# Altium schematic sheet lock_in_amplifier.SchDoc
size Letter; SheetNumber: 2; SheetTotal: 3
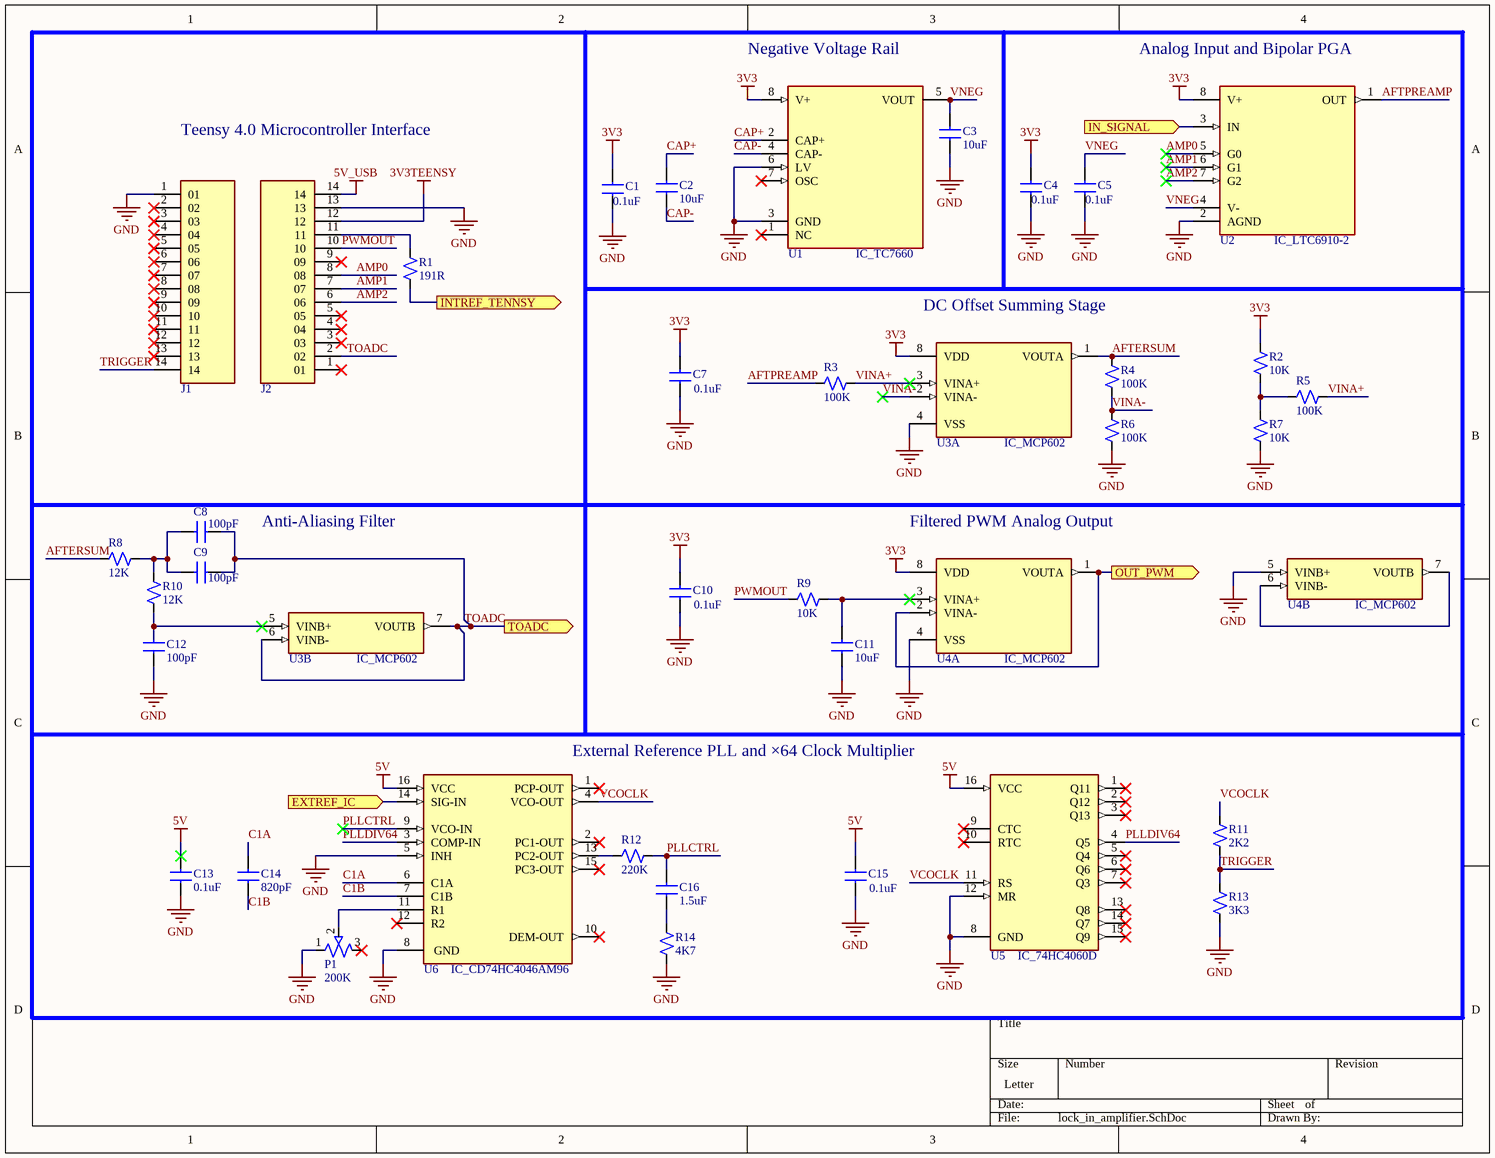
[diagram p0: lock_in_amplifier.SchDoc]

## Parts
C1  value 0.1uF  [CAP_0603]  (hidden comment: CAP_100nF_50V)
C2  value 10uF  [CAP_0805]  (hidden comment: CAP_10uF_16V)
C3  value 10uF  [CAP_0805]  (hidden comment: CAP_10uF_16V)
C4  value 0.1uF  [CAP_0603]  (hidden comment: CAP_100nF_50V)
C5  value 0.1uF  [CAP_0603]  (hidden comment: CAP_100nF_50V)
C7  value 0.1uF  [CAP_0603]  (hidden comment: CAP_100nF_50V)
C8  value 100pF  [CAP_0805]  (hidden comment: CAP_100pF_25V)
C9  value 100pF  [CAP_0805]  (hidden comment: CAP_100pF_25V)
C10  value 0.1uF  [CAP_0603]  (hidden comment: CAP_100nF_50V)
C11  value 10uF  [CAP_0805]  (hidden comment: CAP_10uF_16V)
C12  value 100pF  [CAP_0805]  (hidden comment: CAP_100pF_25V)
C13  value 0.1uF  [CAP_0603]  (hidden comment: CAP_100nF_50V)
C14  value 820pF  [CAP_0805]  (hidden comment: CAP_820pF_25V)
C15  value 0.1uF  [CAP_0603]  (hidden comment: CAP_100nF_50V)
C16  value 1.5uF  [CAP_0805]  (hidden comment: CAP_1.5uF_16V)
J1  SSW-114-01-X-S  [SAMTEC_SSW-114-01-X-S]  (value not drawn)
J2  SSW-114-01-X-S  [SAMTEC_SSW-114-01-X-S]  (value not drawn)
P1  value 200K  [POT_PDB181-K420K-204B]  (hidden comment: POT_200K)
R1  value 191R  [RES_0603]  (hidden comment: RES_191R_0603)
R2  value 10K  [RES_0603]  (hidden comment: RES_10K_0603)
R3  value 100K  [RES_0603]  (hidden comment: RES_100K_0603)
R4  value 100K  [RES_0603]  (hidden comment: RES_100K_0603)
R5  value 100K  [RES_0603]  (hidden comment: RES_100K_0603)
R6  value 100K  [RES_0603]  (hidden comment: RES_100K_0603)
R7  value 10K  [RES_0603]  (hidden comment: RES_10K_0603)
R8  value 12K  [RES_0603]  (hidden comment: RES_12K_0603)
R9  value 10K  [RES_0603]  (hidden comment: RES_10K_0603)
R10  value 12K  [RES_0603]  (hidden comment: RES_12K_0603)
R11  value 2K2  [RES_0603]  (hidden comment: RES_2K2_0603)
R12  value 220K  [RES_0603]  (hidden comment: RES_220K_0603)
R13  value 3K3  [RES_0603]  (hidden comment: RES_3K3_0603)
R14  value 4K7  [RES_0603]  (hidden comment: RES_4K7_0603)
U1  IC_TC7660  [IC_TC7660EOA]
U2  IC_LTC6910-2  [IC_LTC6910-2CTS8#TRMPBF]
U3  IC_MCP602  [IC_MCP602T-I/SN]  (parts A,B of 2)
U4  IC_MCP602  [IC_MCP602T-I/SN]  (parts A,B of 2)
U5  IC_74HC4060D  [IC_74HC4060D-Q100,118]
U6  IC_CD74HC4046AM96  [IC_CD74HC4046AM96]

## Ports
EXTREF_IC (in, see main[3B]), IN_SIGNAL (in, see main[3B]), INTREF_TENNSY (out, see main[3B]), OUT_PWM (out, see main[3B]), TOADC (out, see main[3C])

## Nets
3V3: C1.2 C4.2 C7.2 C10.2 R2.2 U1.8(V+) U2.8(V+) U3.8(VDD) U4.8(VDD)
3V3TEENSY: J2.12
5V: C13.2 C15.2 U5.16(VCC) U6.16(VCC)
5V_USB: J2.14
GND: C1.1 C3.1 C4.1 C5.1 C7.1 C10.1 C11.1 C12.1 C13.1 C15.1 J1.1(01) J2.13 P1.1 R6.1 R7.1 R13.1 R14.1 U1.3(GND) U1.6(LV) U2.2(AGND) U3.4(VSS) U4.4(VSS) U4.5(VINB+) U5.8(GND) U5.12(MR) U6.5(INH) U6.8(GND)
AFTERSUM: R4.2 R8.1 U3.1(VOUTA)
AFTPREAMP: R3.1 U2.1(OUT)
AMP0: J2.8(08) U2.5(G0)
AMP1: J2.7(07) U2.6(G1)
AMP2: J2.6(06) U2.7(G2)
C1A: C14.2 U6.6(C1A)
C1B: C14.1 U6.7(C1B)
CAP+: C2.2 U1.2(CAP+)
CAP-: C2.1 U1.4(CAP-)
EXTREF_IC: U6.14(SIG-IN) ; port EXTREF_IC
IN_SIGNAL: U2.3(IN) ; port IN_SIGNAL
INTREF_TENNSY: R1.1 ; port INTREF_TENNSY
OUT_PWM: U4.1(VOUTA) U4.2(VINA-) ; port OUT_PWM
PLLCTRL: C16.2 R12.1 U6.9(VCO-IN)
PLLDIV64: U5.4(Q5) U6.3(COMP-IN)
PWMOUT: J2.10 R9.1
TOADC: C8.2 C9.2 J2.2(02) U3.6(VINB-) U3.7(VOUTB) ; port TOADC
TRIGGER: J1.14 R11.1 R13.2
VCOCLK: R11.2 U5.11(RS) U6.4(VCO-OUT)
VINA+: R3.2 R5.1 U3.3(VINA+)
VINA-: R4.1 R6.2 U3.2(VINA-)
VNEG: C3.2 C5.2 U1.5(VOUT) U2.4(V-)
NetC8_1: C8.1 C9.1 R8.2 R10.2
NetC11_2: C11.2 R9.2 U4.3(VINA+)
NetC12_2: C12.2 R10.1 U3.5(VINB+)
NetC16_1: C16.1 R14.2
NetJ2_11: J2.11 R1.2
NetP1_2: P1.2 U6.11(R1)
NetR2_1: R2.1 R5.2 R7.2
NetR12_2: R12.2 U6.13(PC2-OUT)
NetU4_6: U4.6(VINB-) U4.7(VOUTB)

Not connected (* = marked no-connect by the designer): J1 2(02)* 3(03)* 4(04)* 5(05)* 6(06)* 7(07)* 8(08)* 9(09)* 10* 11* 12* 13*; J2 1(01)* 3(03)* 4(04)* 5(05)* 9(09)*; P1 3*; U1 1(NC)* 7(OSC)*; U5 1(Q11)* 2(Q12)* 3(Q13)* 5(Q4)* 6(Q6)* 7(Q3)* 9(CTC)* 10(RTC)* 13(Q8)* 14(Q7)* 15(Q9)*; U6 1(PCP-OUT)* 2(PC1-OUT)* 10(DEM-OUT)* 12(R2)* 15(PC3-OUT)*

## Notes on the sheet
- (near U1) Negative Voltage Rail
- (near U2) Analog Input and Bipolar PGA
- Teensy 4.0 Microcontroller Interface
- DC Offset Summing Stage
- Anti-Aliasing Filter
- (near U4) Filtered PWM Analog Output
- External Reference PLL and ×64 Clock Multiplier

## Library data of the parts
C1 C4 C5 C7 C10 C13 C15 = CAP_100nF_50V: 50V 100nF Y5V -20%~+80% 0603; Manufacturer: Walsin Tech Corp; Manufacturer PN: 0603F104Z500CT; Supplier 1: LCSC; ComponentLink1Description: LCSC; ComponentLink1URL: https://www.lcsc.com/product-detail/Multilayer-Ceramic-Capacitors-MLCC-SMD-SMT_Walsin-Tech-Corp-0603F104Z500CT_C83060.html
C2 C3 C11 = CAP_10uF_16V: CAP CER 10UF 25V X5R 0805 ±10%; Manufacturer: Samsung Electro-Mechanics; Manufacturer PN: CL21A106KAYNNNE; Supplier 1: LCSC; ComponentLink2Description: LCSC; ComponentLink2URL: https://lcsc.com/product-detail/Multilayer-Ceramic-Capacitors-MLCC-SMD-SMT_Samsung-Electro-Mechanics-CL21A106KAYNNNE_C15850.html
C8 C9 C12 = CAP_100pF_25V: CAP CER 100PF 25V C0G/NP0 0805 ±5%; Manufacturer: KEMET; Manufacturer PN: C0805C101J3GACTU; Supplier 1: Digi-key; ComponentLink1Description: Digi-key; ComponentLink1URL: https://www.digikey.com/en/products/detail/kemet/C0805C101J3GACTU/2211639
C14 = CAP_820pF_25V: CAP CER 820PF 16V C0G/NP0 0805 ±5%; Manufacturer: Vishay Vitramon; Manufacturer PN: VJ0805D821JXJQJHT; Supplier 1: Digi-key; ComponentLink1Description: Digi-key; ComponentLink1URL: https://www.digikey.com/en/products/detail/vishay-vitramon/VJ0805D821JXJQJHT/14292859
C16 = CAP_1.5uF_16V: CAP CER 0805 1.5UF 16V X7R 5%; Manufacturer: KEMET; Manufacturer PN: C0805C155J4REC7210; Supplier 1: Digi-key; ComponentLink1Description: Digi-key; ComponentLink1URL: https://www.digikey.com/en/products/detail/kemet/C0805C155J4REC7210/8645141
J1 J2 = SSW-114-01-X-S: 14 Position Receptacle Connector 0.100 (2.54mm) Through Hole Gold; Manufacturer: Samtec Inc.; Manufacturer PN: SSW-114-01-G-S; Supplier 1: Digi-key; ComponentLink1Description: Digi-key; ComponentLink1URL: https://www.digikey.com/es/products/category/conectores-rectangulares/2027?s=N4IgTCBcDaIMpwOoFoCMqAsyAMrkHFk4QBdAXyA
P1 = POT_200K: POT 200K OHM 1/5W CARBON LINEAR; Manufacturer: Bourns Inc.; Manufacturer PN: PDB181-K420K-204B; Supplier 1: Digi-key; ComponentLink1Description: Digi-key; ComponentLink1URL: https://www.digikey.com/en/products/detail/bourns-inc/PDB181-K420K-204B/2564754
R1 = RES_191R_0603: 100mW Thick Film Resistor 75V ±1% 191Ω 0603 Chip Resistor - Surface Mount ROHS; Manufacturer: FOJAN; Manufacturer PN: FRC0603F1910TS; Supplier 1: LCSC; ComponentLink1Description: LCSC; ComponentLink1URL: https://lcsc.com/product-detail/Chip-Resistor-Surface-Mount_FOJAN-FRC0603F1910TS_C3000718.html
R2 R7 R9 = RES_10K_0603: RES 10K OHM 1% 1/10W 0603; Manufacturer: YAGEO; Manufacturer PN: RC0603FR-0710KL; Supplier 1: Digi-key; ComponentLink1Description: Digi-key; ComponentLink1URL: https://www.digikey.com/en/products/detail/yageo/RC0603FR-0710KL/726880?s=N4IgTCBcDaIEoGEAMA2JBmAYnAtEg7AIxIDSAMiALoC%2BQA
R3-R6 = RES_100K_0603: RES 100K OHM 1% 1/10W 0603; Manufacturer: YAGEO; Manufacturer PN: RC0603FR-07100KL; Supplier 1: Digi-key; ComponentLink1Description: Digi-key; ComponentLink1URL: https://www.digikey.com/en/products/detail/yageo/RC0603FR-07100KL/726889?s=N4IgTCBcDaIEoGEAMA2JBmAYnAtEg7AIxJIDSAMiALoC%2BQA
R8 R10 = RES_12K_0603: RES 12K OHM 1% 1/10W 0603; Manufacturer: YAGEO; Manufacturer PN: RC0603FR-0712KL; Supplier 1: Digi-key; ComponentLink1Description: Digi-key; ComponentLink1URL: https://www.digikey.com/en/products/detail/yageo/RC0603FR-0712KL/726913?s=N4IgTCBcDaIEoGEAMA2JBmAYnAtEg7AIxgDSAMiALoC%2BQA
R11 = RES_2K2_0603: RES 2.2K OHM 1% 1/10W 0603; Manufacturer: YAGEO; Manufacturer PN: RC0603FR-072K2L; Supplier 1: Digi-key; ComponentLink1Description: Digi-key; ComponentLink1URL: https://www.digikey.com/en/products/detail/yageo/RC0603FR-072K2L/727016?s=N4IgTCBcDaIEoGEAMA2JBmAYnAtEg7GANJgAyIAugL5A
R12 = RES_220K_0603: RES 220K OHM 1% 1/10W 0603; Manufacturer: YAGEO; Manufacturer PN: RC0603FR-07220KL; Supplier 1: Digi-key; ComponentLink1Description: Digi-key; ComponentLink1URL: https://www.digikey.com/en/products/detail/yageo/RC0603FR-07220KL/727062?s=N4IgTCBcDaIEoGEAMA2JBmAYnAtEg7GGEgNIAyIAugL5A
R13 = RES_3K3_0603: RES 3.3K OHM 5% 1/10W 0603; Manufacturer: FOJAN; Manufacturer PN: FRC0603J332 TS; Supplier 1: LCSC; ComponentLink1Description: LCSC; ComponentLink1URL: https://www.lcsc.com/product-detail/Chip-Resistor-Surface-Mount_FOJAN-FRC0603J332-TS_C2907140.html
R14 = RES_4K7_0603: RES 4.7K OHM 1% 1/10W 0603; Manufacturer: VO; Manufacturer PN: SCR0603F4K7; Supplier 1: LCSC; ComponentLink1Description: LCSC; ComponentLink1URL: https://lcsc.com/product-detail/Chip-Resistor-Surface-Mount_VO-SCR0603F4K7_C3016318.html
U1 = IC_TC7660: Charge Pump Switching Regulator IC Positive or Negative Fixed -Vin, 2Vin 1 Output 20mA 8-SOIC; Manufacturer: Microchip Technology; Manufacturer PN: TC7660EOA; Supplier 1: Digi-key; ComponentLink1Description: Digi-key; ComponentLink1URL: https://www.digikey.com/en/products/detail/microchip-technology/TC7660EOA/418700?s=N4IgTCBcDaICoGEDsA2FAGAogeQIIFoA5AERAF0BfIA
U2 = IC_LTC6910-2: Programmable Gain Amplifier 1 Circuit Rail-to-Rail TSOT-23-8; Manufacturer: Analog Devices Inc.; Manufacturer PN: LTC6910-2CTS8#TRMPBF; Supplier 1: Digi-key; ComponentLink1Description: Digi-key; ComponentLink1URL: https://www.digikey.com/en/products/detail/analog-devices-inc/LTC6910-2CTS8-TRMPBF/1115904?s=N4IgTCBcDaIDIBUDCA2AnARgAwFoxIQGUAOAYgQCUBZABQCEAxEAXQF8g
U3 U4 = IC_MCP602: IC CMOS 2 CIRCUIT 8SOIC OP-AMP; Manufacturer: Microchip Technology; Manufacturer PN: MCP602T-I/SN; Supplier 1: Digi-key; ComponentLink1Description: Digi-key; ComponentLink1URL: https://www.digikey.com/en/products/detail/microchip-technology/MCP602T-I-SN/319452?s=N4IgTCBcDaILIGEAKA2ADGAKgWgJIHoBlAORAF0BfIA
U5 = IC_74HC4060D: Counter IC Binary Counter 1 Element 14 Bit Negative Edge 16-SO; Manufacturer: Nexperia USA Inc.; Manufacturer PN: 74HC4060D-Q100,118; Supplier 1: Digi-key; ComponentLink1Description: Digi-key; ComponentLink1URL: https://www.digikey.com/en/products/detail/nexperia-usa-inc/74HC4060D-Q100-118/3678893?s=N4IgTCBcDaIOwBYASBhBAGAbOgIgWgEUBGddAGiKIA4QBdAXyA
U6 = IC_CD74HC4046AM96: Phase Lock Loop (PLL) IC 38MHz 1 16-SOIC; Manufacturer: Texas Instruments; Manufacturer PN: CD74HC4046AM96; Supplier 1: Digi-key; ComponentLink1Description: Digi-key; ComponentLink1URL: https://www.digikey.com/en/products/detail/texas-instruments/CD74HC4046AM96/555594